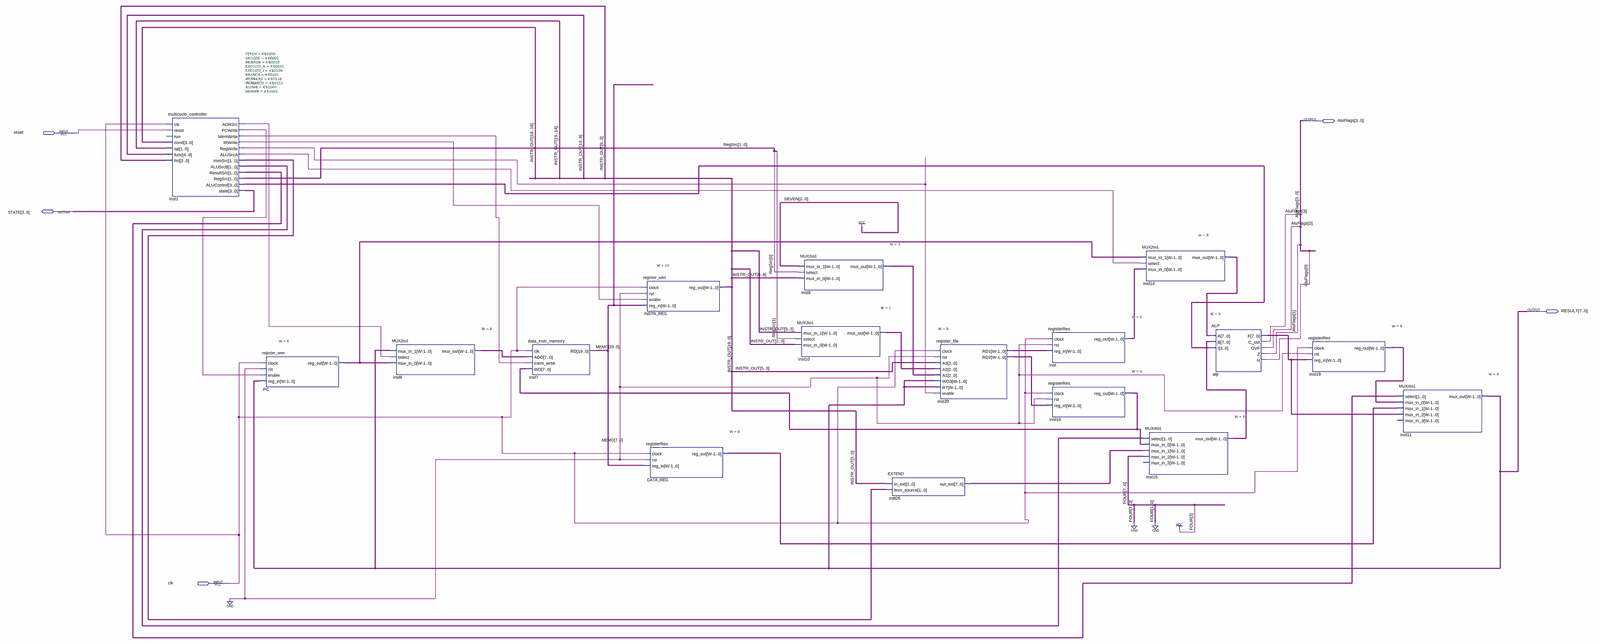
[diagram p0: schematic sheet, whole]
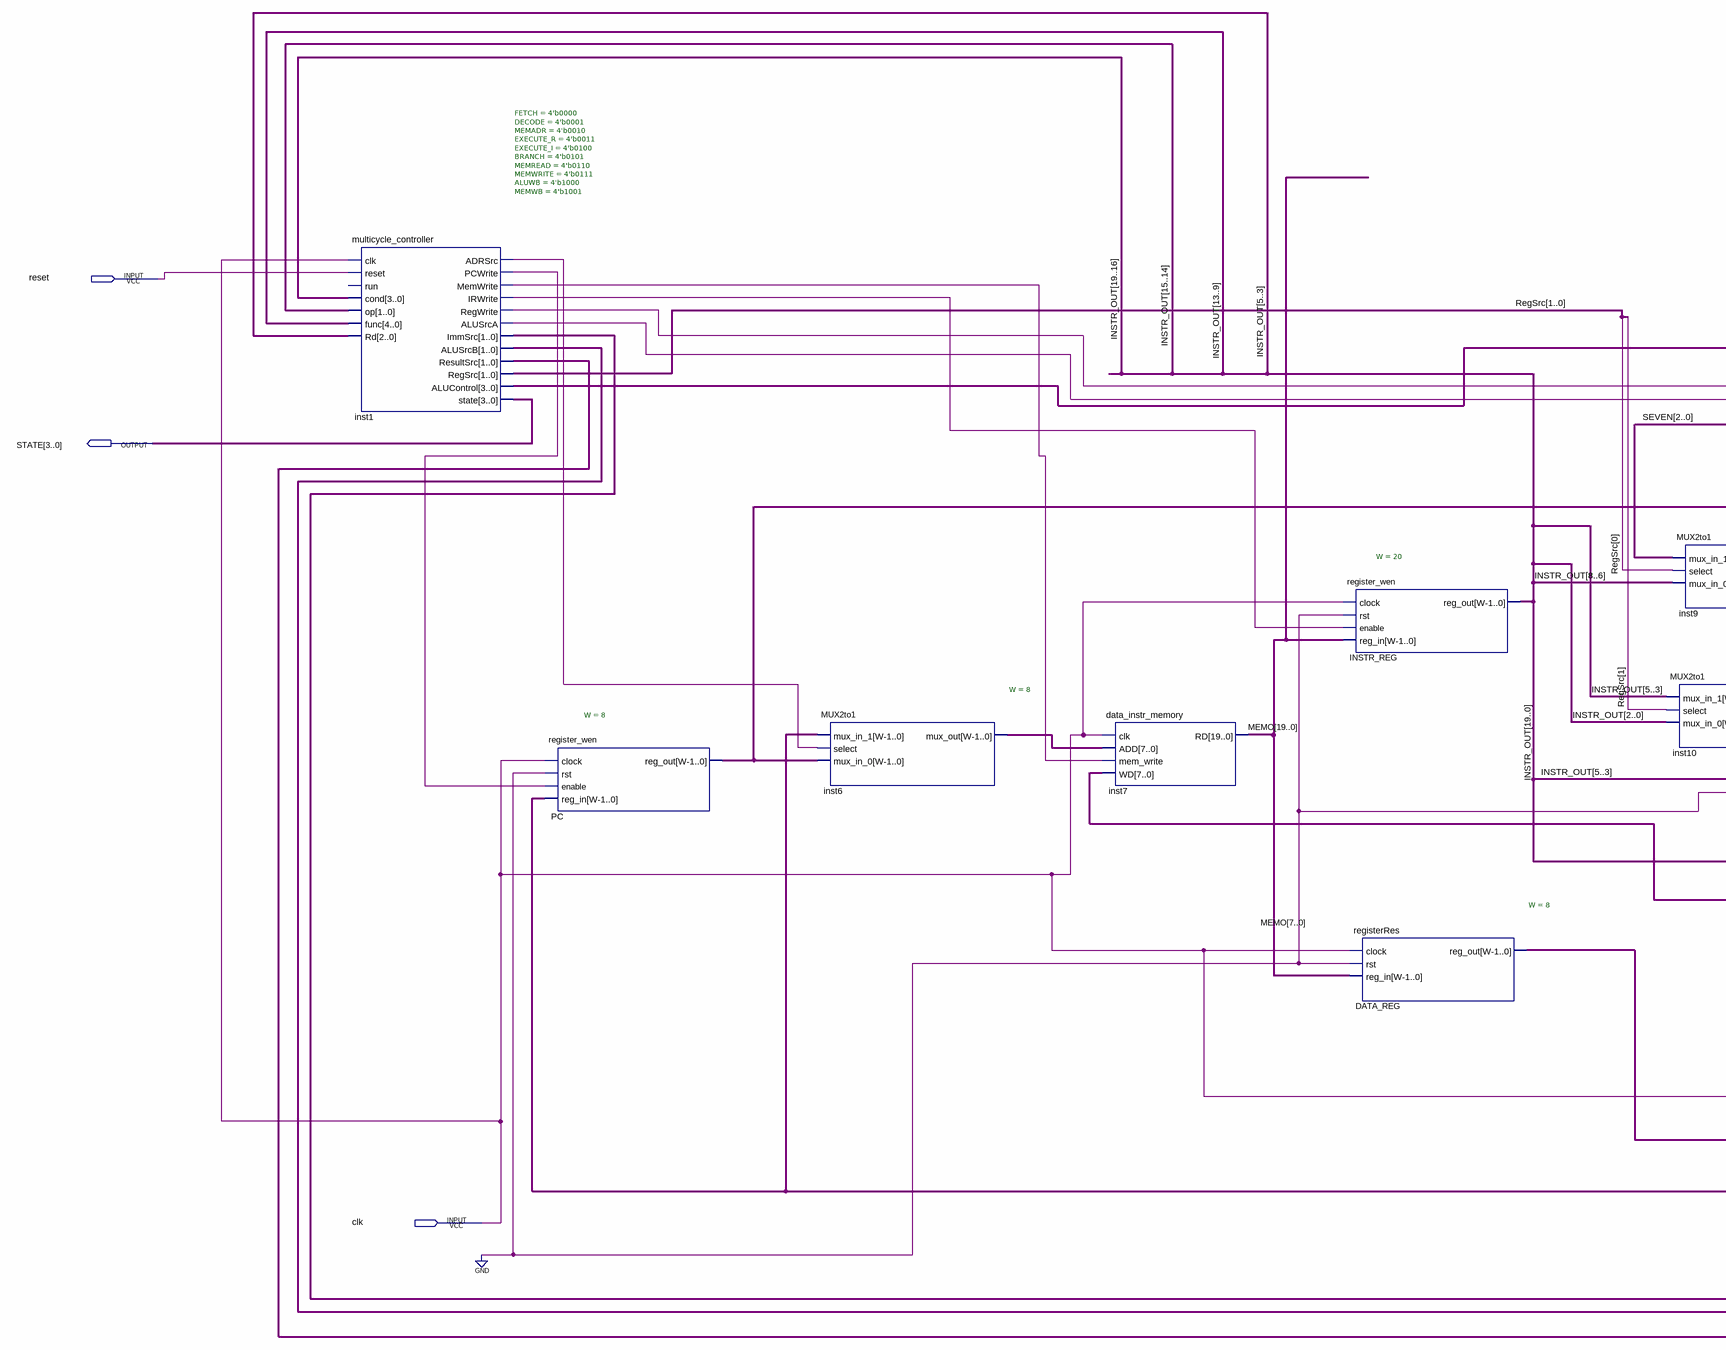
[diagram p1: schematic sheet, left part]
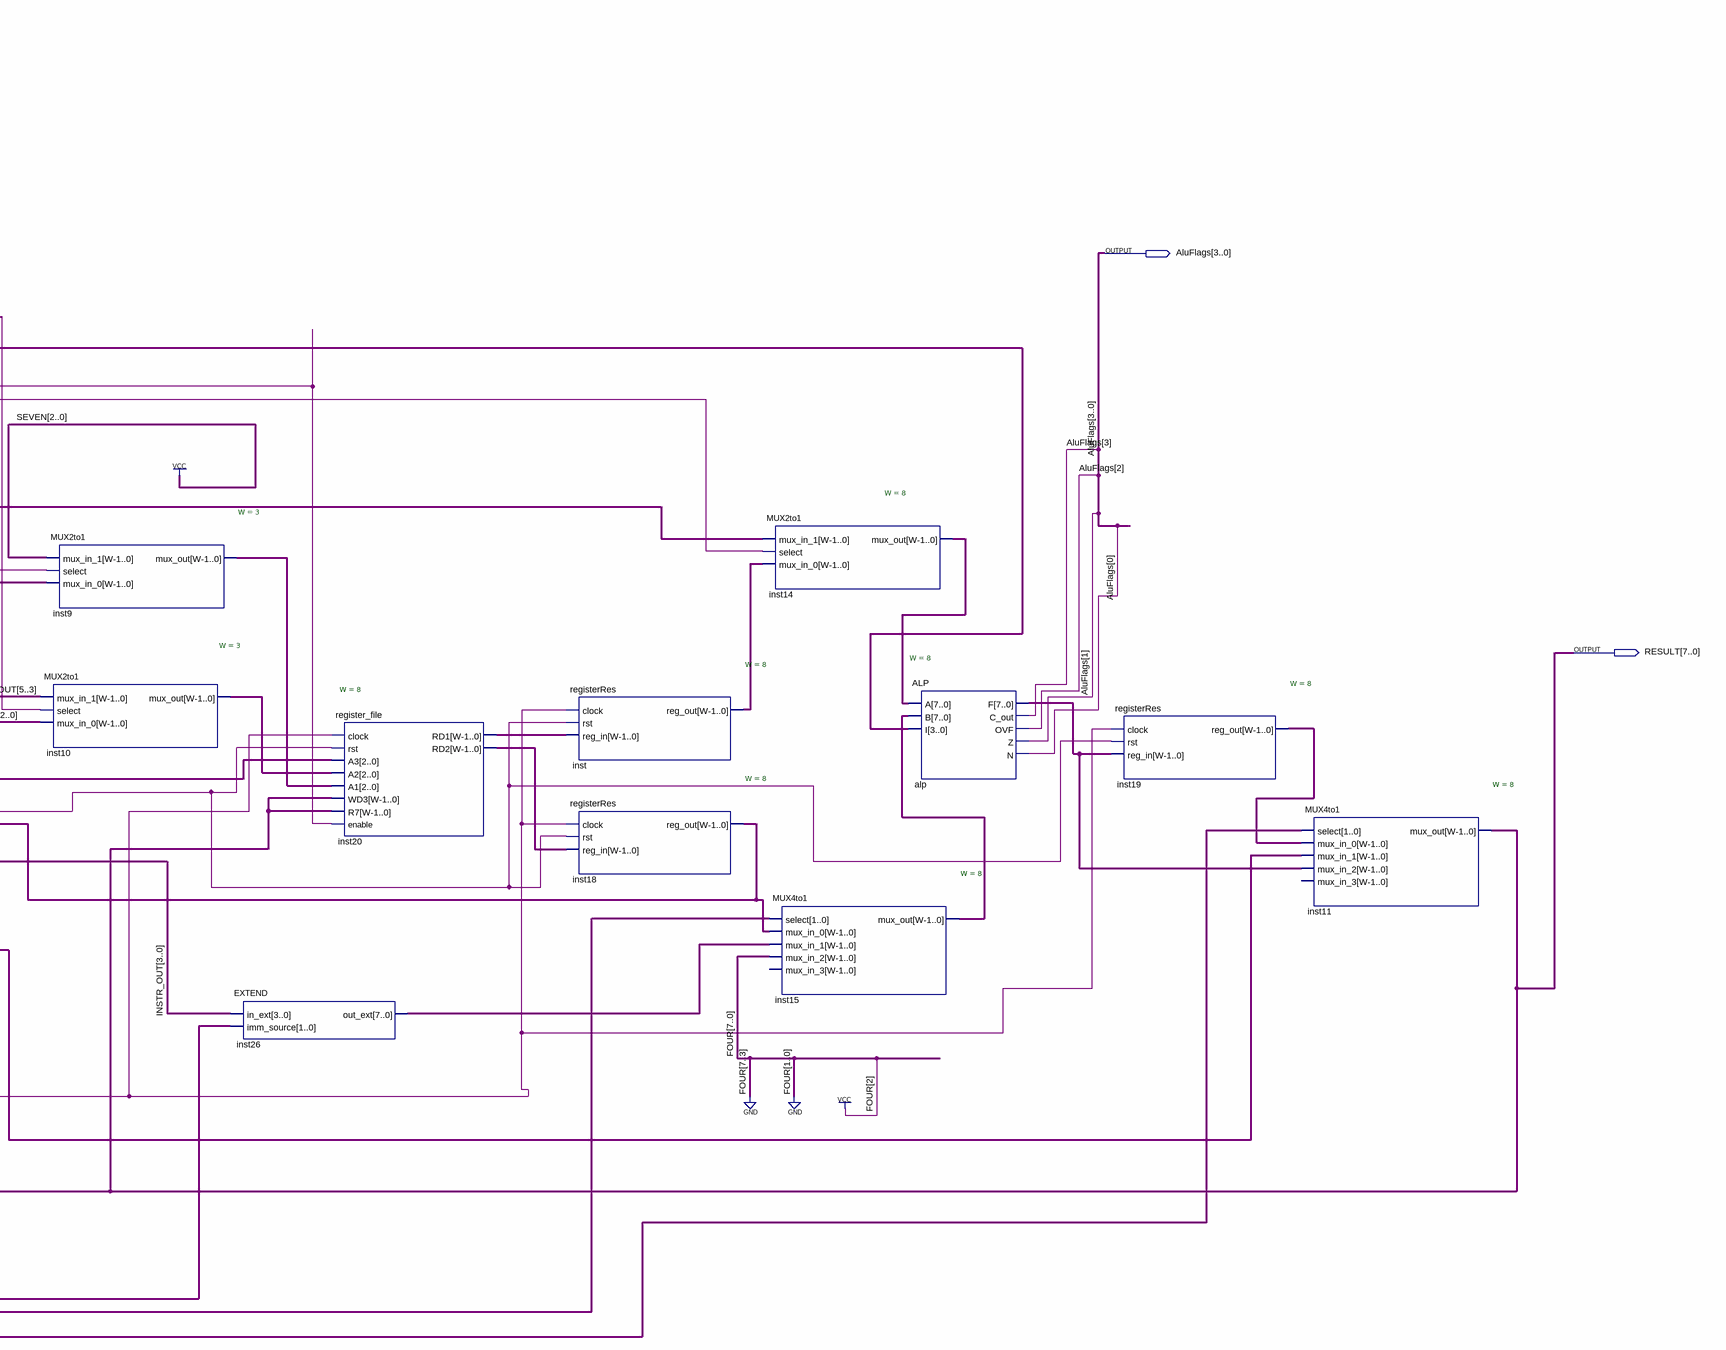
[diagram p2: schematic sheet, right part]
// Quartus schematic multi_cycle_CPU.bdf as structural Verilog: 17 symbols, 5 pins
module multi_cycle_CPU (
  input  reset,
  input  clk,
  output [3:0] AluFlags,
  output [3:0] STATE,
  output [7:0] RESULT
);

  wire inst1_adrsrc, inst1_alusrca, inst1_irwrite, inst1_memwrite, inst1_pcwrite, inst1_regwrite;
  wire [1:0] inst1_alusrcb, inst1_immsrc, inst1_resultsrc, RegSrc;
  wire [2:0] inst9_mux_out, inst10_mux_out;
  wire [3:0] inst1_alucontrol;
  wire [7:0] alp_f, DATA_REG_reg_out, inst6_mux_out, inst14_mux_out, inst15_mux_out, inst18_reg_out,
       inst19_reg_out, inst20_rd1, inst20_rd2, inst26_out_ext, inst_reg_out, PC_reg_out;
  wire [19:0] INSTR_OUT, MEMO;

  multicycle_controller #(.FETCH(4'b0000), .DECODE(4'b0001), .MEMADR(4'b0010), .EXECUTE_R(4'b0011), .EXECUTE_I(4'b0100), .BRANCH(4'b0101), .MEMREAD(4'b0110), .MEMWRITE(4'b0111), .ALUWB(4'b1000), .MEMWB(4'b1001)) inst1 (
    .clk(clk), .reset(reset), .cond(INSTR_OUT[19:16]), .op(INSTR_OUT[15:14]), .func(INSTR_OUT[13:9]),
    .Rd(INSTR_OUT[5:3]), .ADRSrc(inst1_adrsrc), .PCWrite(inst1_pcwrite), .MemWrite(inst1_memwrite),
    .IRWrite(inst1_irwrite), .RegWrite(inst1_regwrite), .ALUSrcA(inst1_alusrca), .ImmSrc(inst1_immsrc),
    .ALUSrcB(inst1_alusrcb), .ResultSrc(inst1_resultsrc), .RegSrc(RegSrc), .ALUControl(inst1_alucontrol),
    .state(STATE));  // open: run
  register_wen #(.W(8)) PC (.clock(clk), .rst(1'b0), .enable(inst1_pcwrite), .reg_in(RESULT), .reg_out(PC_reg_out));
  MUX2to1 #(.W(8)) inst6 (.mux_in_1(RESULT), .select(inst1_adrsrc), .mux_in_0(PC_reg_out), .mux_out(inst6_mux_out));
  data_instr_memory inst7 (.clk(clk), .ADD(inst6_mux_out), .mem_write(inst1_memwrite), .WD(inst18_reg_out), .RD(MEMO));
  register_wen #(.W(20)) INSTR_REG (
    .clock(clk), .rst(1'b0), .enable(inst1_irwrite), .reg_in(MEMO), .reg_out(INSTR_OUT));
  registerRes #(.W(8)) DATA_REG (.clock(clk), .rst(1'b0), .reg_in(MEMO[7:0]), .reg_out(DATA_REG_reg_out));
  MUX2to1 #(.W(3)) inst9 (.mux_in_1(3'b111), .select(RegSrc[0]), .mux_in_0(INSTR_OUT[8:6]), .mux_out(inst9_mux_out));
  MUX2to1 #(.W(3)) inst10 (
    .mux_in_1(INSTR_OUT[5:3]), .select(RegSrc[1]), .mux_in_0(INSTR_OUT[2:0]), .mux_out(inst10_mux_out));
  EXTEND inst26 (.in_ext(INSTR_OUT[3:0]), .imm_source(inst1_immsrc), .out_ext(inst26_out_ext));
  register_file #(.W(8)) inst20 (
    .clock(clk), .rst(1'b0), .A3(INSTR_OUT[5:3]), .A2(inst10_mux_out), .A1(inst9_mux_out), .WD3(RESULT),
    .R7(RESULT), .enable(inst1_regwrite), .RD1(inst20_rd1), .RD2(inst20_rd2));
  registerRes #(.W(8)) inst (.clock(clk), .rst(1'b0), .reg_in(inst20_rd1), .reg_out(inst_reg_out));
  registerRes #(.W(8)) inst18 (.clock(clk), .rst(1'b0), .reg_in(inst20_rd2), .reg_out(inst18_reg_out));
  MUX2to1 #(.W(8)) inst14 (
    .mux_in_1(PC_reg_out), .select(inst1_alusrca), .mux_in_0(inst_reg_out), .mux_out(inst14_mux_out));
  MUX4to1 #(.W(8)) inst15 (
    .select(inst1_alusrcb), .mux_in_0(inst18_reg_out), .mux_in_1(inst26_out_ext), .mux_in_2(8'b00000100),
    .mux_out(inst15_mux_out));  // open: mux_in_3
  ALP #(.W(8)) alp (
    .A(inst14_mux_out), .B(inst15_mux_out), .I(inst1_alucontrol), .F(alp_f), .C_out(AluFlags[3]),
    .OVF(AluFlags[2]), .Z(AluFlags[1]), .N(AluFlags[0]));
  registerRes #(.W(8)) inst19 (.clock(clk), .rst(1'b0), .reg_in(alp_f), .reg_out(inst19_reg_out));
  MUX4to1 #(.W(8)) inst11 (
    .select(inst1_resultsrc), .mux_in_0(inst19_reg_out), .mux_in_1(DATA_REG_reg_out), .mux_in_2(alp_f),
    .mux_out(RESULT));  // open: mux_in_3
endmodule
